# Altium schematic sheet motor_surucu.SchDoc
size 250 x 180 mm
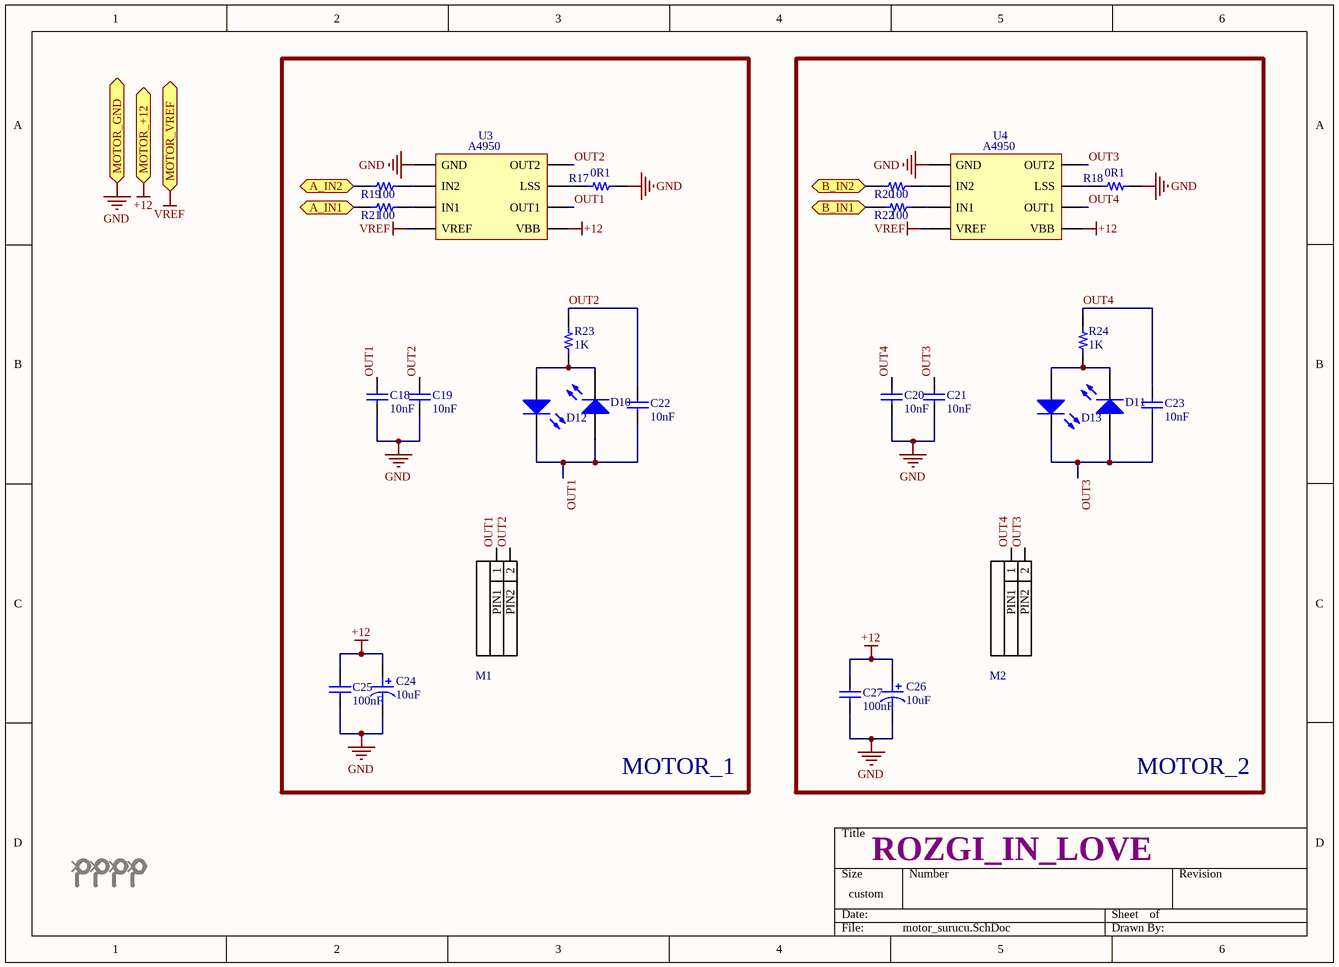
[diagram p0: motor_surucu.SchDoc]

## Parts
1  VİDA  [M2]  (value not drawn)
2  VİDA  [M2]  (value not drawn)
3  VİDA  [M2]  (value not drawn)
4  VİDA  [M2]  (value not drawn)
C18  10nF  [CAP SMD C0603]
C19  10nF  [CAP SMD C0603]
C20  10nF  [CAP SMD C0603]
C21  10nF  [CAP SMD C0603]
C22  10nF  [CAP SMD C0603]
C23  10nF  [CAP SMD C0603]
C24  10uF  [Cap Tantal 3528 - Type B]
C25  100nF  [CAP SMD C0603]
C26  10uF  [Cap Tantal 3528 - Type B]
C27  100nF  [CAP SMD C0603]
D10  (no value)  [LED 0603/1608 GREEN]
D11  (no value)  [LED 0603/1608 GREEN]
D12  (no value)  [LED 0603/1608 RED]
D13  (no value)  [LED 0603/1608 RED]
M1  Ğàçú¸ì PLS-2  [HDR1X2]  (value not drawn)
M2  Ğàçú¸ì PLS-2  [HDR1X2]  (value not drawn)
R17  0R1  [STACKPOLE CSRN2512]
R18  0R1  [STACKPOLE CSRN2512]
R19  100  [RES 0603]
R20  100  [RES 0603]
R21  100  [RES 0603]
R22  100  [RES 0603]
R23  1K  [RES 0603]
R24  1K  [RES 0603]
U3  A4950  [SOIC8-EP_motor]
U4  A4950  [SOIC8-EP_motor]

## Blocks framed on the sheet
MOTOR_1: C18 C19 C22 C24 C25 D10 D12 M1 R17 R19 R21 R23 U3
MOTOR_2: C20 C21 C23 C26 C27 D11 D13 M2 R18 R20 R22 R24 U4

## Ports
A_IN1, A_IN2, B_IN1, B_IN2, MOTOR_+12, MOTOR_GND, MOTOR_VREF

## Nets
+12: C24.1 C25.2 C26.1 C27.2 U3.5(VBB) U4.5(VBB) ; port MOTOR_+12
GND: C18.1 C19.1 C20.1 C21.1 C24.2 C25.1 C26.2 C27.1 R17.2 R18.2 U3.1(GND) U4.1(GND) ; port MOTOR_GND
VREF: U3.4(VREF) U4.4(VREF) ; port MOTOR_VREF
A_IN1: R21.1 ; port A_IN1
A_IN2: R19.1 ; port A_IN2
B_IN1: R22.1 ; port B_IN1
B_IN2: R20.1 ; port B_IN2
OUT1: C18.2 C22.1 D10.2(A) D12.1(C) M1.1(PIN1) U3.6(OUT1)
OUT2: C19.2 C22.2 M1.2(PIN2) R23.2 U3.8(OUT2)
OUT3: C21.2 C23.1 D11.2(A) D13.1(C) M2.2(PIN2) U4.8(OUT2)
OUT4: C20.2 C23.2 M2.1(PIN1) R24.2 U4.6(OUT1)
NetD10_1: D10.1(C) D12.2(A) R23.1
NetD11_1: D11.1(C) D13.2(A) R24.1
NetR17_1: R17.1 U3.7(LSS)
NetR18_1: R18.1 U4.7(LSS)
NetR19_2: R19.2 U3.2(IN2)
NetR20_2: R20.2 U4.2(IN2)
NetR21_2: R21.2 U3.3(IN1)
NetR22_2: R22.2 U4.3(IN1)

## Notes on the sheet
- ROZGI_IN_LOVE

## Library data of the parts
C18-C23 C25 C27 = CAP SMD THT: CAP SMD
  C18-C23: Value: 10nF
  C25 C27: Value: 100nF
C24 C26 = CAP-SMD -TANTAL: CAP-TANTAL; Value: 10uF
D10-D13 = LED: Typical LED; Voltage: 3V; Current: 20mA; ComponentLink2Description: Datasheet
M1 M2 = HDR 1x2: Male, 2 pin single in line, 2.54; ComponentLink1Description: Ñàéò ïğîèçâîäèòåëÿ; ComponentLink2Description: Datasheet; Device: PLS-2; Family: Ğàçú¸ì; ComponentLink3Description: Ãäå êóïèòü?
R17-R22 = RES: Value: 1K
R23 R24 = RES: Value: 1K